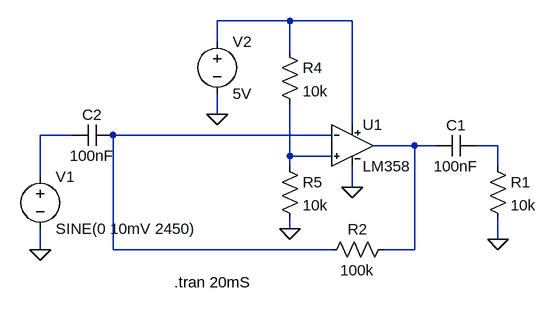
[diagram p0: schematic lm358.asc]
lm358.asc, the LTspice schematic file:
Version 4
SHEET 1 880 680
WIRE 64 -16 -48 -16
WIRE 160 -16 64 -16
WIRE -48 16 -48 -16
WIRE 64 32 64 -16
WIRE -48 128 -48 96
WIRE 160 144 160 -16
WIRE -272 160 -320 160
WIRE 128 160 -208 160
WIRE 256 176 192 176
WIRE 288 176 256 176
WIRE 384 176 352 176
WIRE 64 192 64 112
WIRE 128 192 64 192
WIRE 64 208 64 192
WIRE 384 208 384 176
WIRE -320 224 -320 160
WIRE 160 240 160 208
WIRE 64 304 64 288
WIRE 384 320 384 288
WIRE -320 336 -320 304
WIRE -208 336 -208 160
WIRE 128 336 -208 336
WIRE 256 336 256 176
WIRE 256 336 208 336
FLAG 160 240 0
FLAG -320 336 0
FLAG -48 128 0
FLAG 384 320 0
FLAG 64 304 0
SYMBOL LM358 160 112 R0
SYMATTR InstName U1
SYMBOL voltage -48 0 R0
WINDOW 123 0 0 Left 0
WINDOW 39 0 0 Left 0
SYMATTR InstName V2
SYMATTR Value 5V
SYMBOL cap 352 160 R90
WINDOW 0 0 32 VBottom 2
WINDOW 3 32 32 VTop 2
SYMATTR InstName C1
SYMATTR Value 100nF
SYMBOL res 368 192 R0
SYMATTR InstName R1
SYMATTR Value 10k
SYMBOL res 224 320 R90
WINDOW 0 0 56 VBottom 2
WINDOW 3 32 56 VTop 2
SYMATTR InstName R2
SYMATTR Value 100k
SYMBOL voltage -320 208 R0
WINDOW 123 0 0 Left 0
WINDOW 39 0 0 Left 0
SYMATTR InstName V1
SYMATTR Value SINE(0 10mV 2450)
SYMBOL res 48 16 R0
SYMATTR InstName R4
SYMATTR Value 10k
SYMBOL res 48 192 R0
SYMATTR InstName R5
SYMATTR Value 10k
SYMBOL cap -208 144 R90
WINDOW 0 0 32 VBottom 2
WINDOW 3 32 32 VTop 2
SYMATTR InstName C2
SYMATTR Value 100nF
TEXT -114 386 Left 2 !.tran 20mS

The netlist it stands for:
* lm358.asc
XU1 N006 N003 N001 0 N004 LM358  ; pins In+ In- V+ V- OUT
V2 N001 0 5V
C1 N005 N004 100nF
R1 N005 0 10k
R2 N004 N003 100k
V1 N002 0 SINE(0 10mV 2450)
R4 N001 N006 10k
R5 N006 0 10k
C2 N003 N002 100nF
.tran 20mS
.lib LM358.sub
.backanno
.end